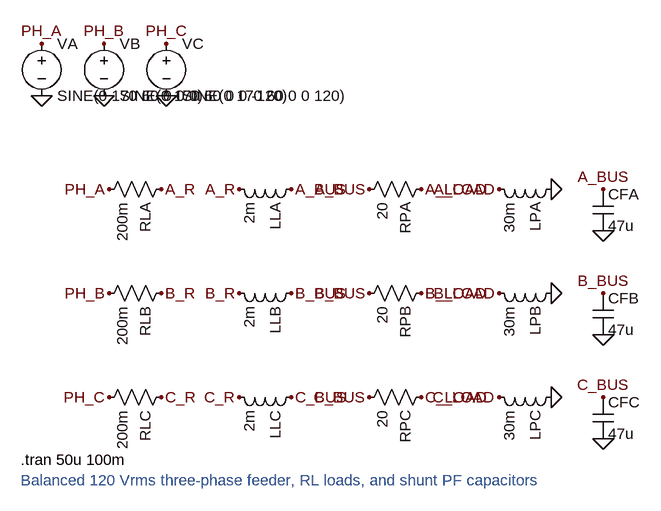
[diagram p0: schematic 17_three_phase_power_grid.asc]
17_three_phase_power_grid.asc, the LTspice schematic file:
Version 4
SHEET 1 1280 820
FLAG 80 96 PH_A
FLAG 80 176 0
FLAG 176 96 PH_B
FLAG 176 176 0
FLAG 272 96 PH_C
FLAG 272 176 0
FLAG 184 320 PH_A
FLAG 264 320 A_R
FLAG 384 320 A_R
FLAG 464 320 A_BUS
FLAG 584 320 A_BUS
FLAG 664 320 A_LOAD
FLAG 784 320 A_LOAD
FLAG 864 320 0
FLAG 944 320 A_BUS
FLAG 944 384 0
FLAG 184 480 PH_B
FLAG 264 480 B_R
FLAG 384 480 B_R
FLAG 464 480 B_BUS
FLAG 584 480 B_BUS
FLAG 664 480 B_LOAD
FLAG 784 480 B_LOAD
FLAG 864 480 0
FLAG 944 480 B_BUS
FLAG 944 544 0
FLAG 184 640 PH_C
FLAG 264 640 C_R
FLAG 384 640 C_R
FLAG 464 640 C_BUS
FLAG 584 640 C_BUS
FLAG 664 640 C_LOAD
FLAG 784 640 C_LOAD
FLAG 864 640 0
FLAG 944 640 C_BUS
FLAG 944 704 0
SYMBOL voltage 80 80 R0
SYMATTR InstName VA
SYMATTR Value SINE(0 170 60 0 0 0)
SYMBOL voltage 176 80 R0
SYMATTR InstName VB
SYMATTR Value SINE(0 170 60 0 0 -120)
SYMBOL voltage 272 80 R0
SYMATTR InstName VC
SYMATTR Value SINE(0 170 60 0 0 120)
SYMBOL res 280 304 R90
SYMATTR InstName RLA
SYMATTR Value 200m
SYMBOL ind 480 304 R90
SYMATTR InstName LLA
SYMATTR Value 2m
SYMBOL res 680 304 R90
SYMATTR InstName RPA
SYMATTR Value 20
SYMBOL ind 880 304 R90
SYMATTR InstName LPA
SYMATTR Value 30m
SYMBOL cap 928 320 R0
SYMATTR InstName CFA
SYMATTR Value 47u
SYMBOL res 280 464 R90
SYMATTR InstName RLB
SYMATTR Value 200m
SYMBOL ind 480 464 R90
SYMATTR InstName LLB
SYMATTR Value 2m
SYMBOL res 680 464 R90
SYMATTR InstName RPB
SYMATTR Value 20
SYMBOL ind 880 464 R90
SYMATTR InstName LPB
SYMATTR Value 30m
SYMBOL cap 928 480 R0
SYMATTR InstName CFB
SYMATTR Value 47u
SYMBOL res 280 624 R90
SYMATTR InstName RLC
SYMATTR Value 200m
SYMBOL ind 480 624 R90
SYMATTR InstName LLC
SYMATTR Value 2m
SYMBOL res 680 624 R90
SYMATTR InstName RPC
SYMATTR Value 20
SYMBOL ind 880 624 R90
SYMATTR InstName LPC
SYMATTR Value 30m
SYMBOL cap 928 640 R0
SYMATTR InstName CFC
SYMATTR Value 47u
TEXT 48 736 Left 2 !.tran 50u 100m
TEXT 48 768 Left 2 ;Balanced 120 Vrms three-phase feeder, RL loads, and shunt PF capacitors

The netlist it stands for:
* 17_three_phase_power_grid.asc
VA PH_A 0 SINE(0 170 60 0 0 0)
VB PH_B 0 SINE(0 170 60 0 0 -120)
VC PH_C 0 SINE(0 170 60 0 0 120)
RLA A_R PH_A 200m
LLA A_BUS A_R 2m
RPA A_LOAD A_BUS 20
LPA 0 A_LOAD 30m
CFA A_BUS 0 47u
RLB B_R PH_B 200m
LLB B_BUS B_R 2m
RPB B_LOAD B_BUS 20
LPB 0 B_LOAD 30m
CFB B_BUS 0 47u
RLC C_R PH_C 200m
LLC C_BUS C_R 2m
RPC C_LOAD C_BUS 20
LPC 0 C_LOAD 30m
CFC C_BUS 0 47u
.tran 50u 100m
* Balanced 120 Vrms three-phase feeder, RL loads, and shunt PF capacitors
.backanno
.end